# EAGLE design Power-Resistor-Breakout-3W-v001 (EAGLE 6.0)
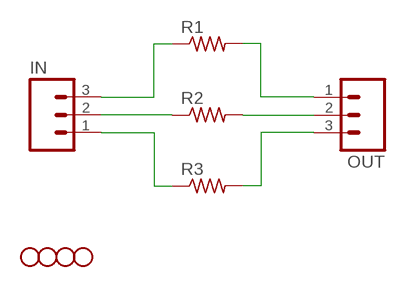
[diagram p0: schematic, sheet 1]

## Parts
IN  M03PTH  [1X03]
JP1  STAND-OFF  [STAND-OFF]
JP2  STAND-OFF  [STAND-OFF]
JP3  STAND-OFF  [STAND-OFF]
JP4  STAND-OFF  [STAND-OFF]
OUT  M03PTH  [1X03]
R1  R-US_0411/15  [0411/15]
R2  R-US_0411/15  [0411/15]
R3  R-US_0411/15  [0411/15]

## Nets
N$1: IN.2 R2.1
N$2: OUT.2 R2.2
N$3: IN.3 R1.1
N$4: IN.1 R3.1
N$5: OUT.3 R3.2
N$6: OUT.1 R1.2

## Library data of the parts
IN OUT = SparkFun:M03: Header 3 Standard 3-pin 0.1" header. Use with straight break away headers (SKU : PRT-00116), right angle break away headers (PRT-00553), swiss pins (PRT-00743), machine pins (PRT-00117), and female headers (PRT-00115). Molex polarized connector foot print use with SKU : PRT-08232 with associated crimp pins and housings.
JP1-JP4 = SparkFun:STAND-OFF: Stand Off This is the mechanical footprint for a #4 phillips button head screw. Use the keepout ring to avoid running the screw head into surrounding components. SKU : PRT-00447
R1-R3 = resistor:R-US_: RESISTOR, American symbol

## Board
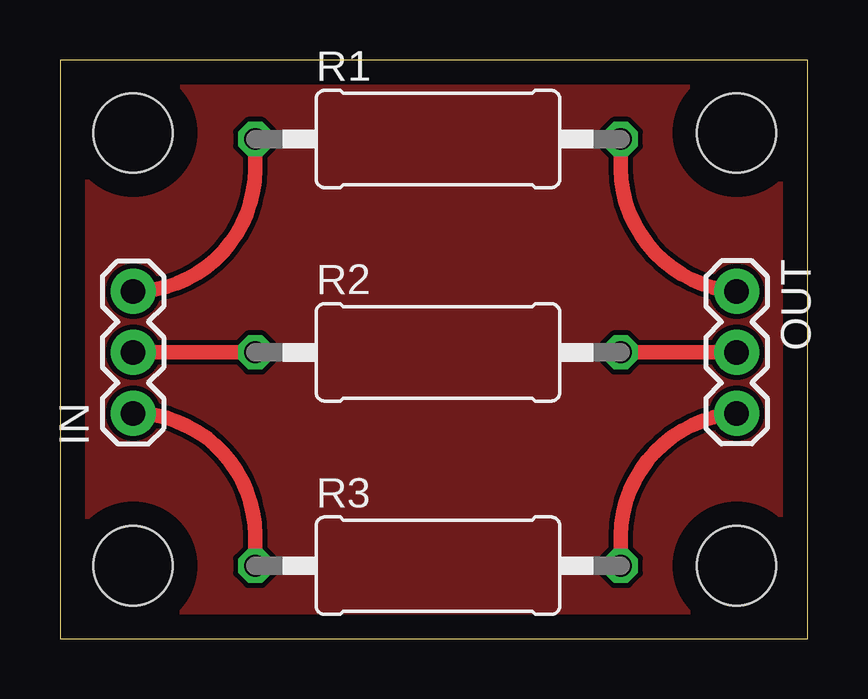
[diagram p1: board, top side]
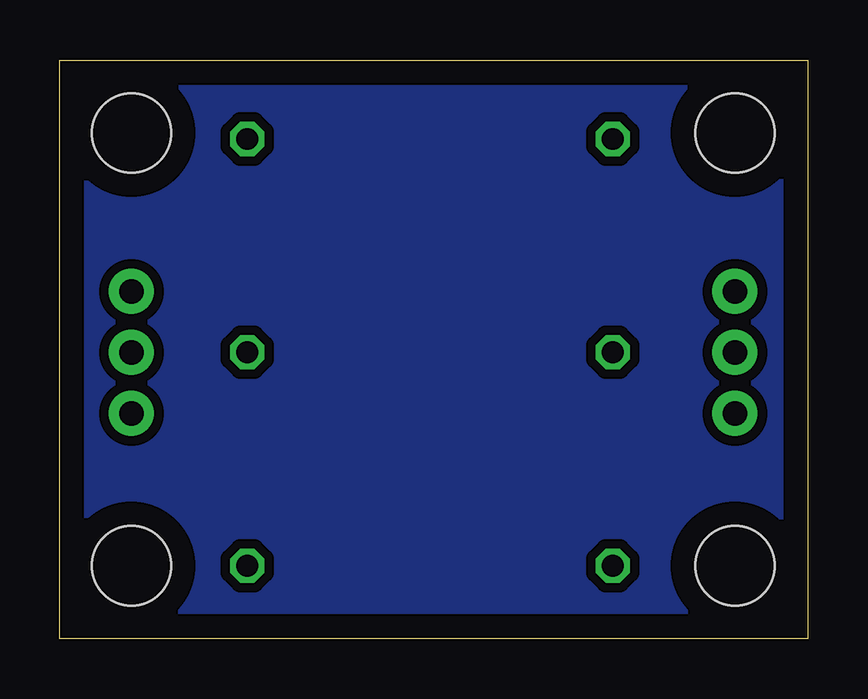
[diagram p2: board, bottom side, seen from below]

Size 31.17 x 24.12 mm. Coordinates in mm from the lower left corner, seen from the top.
Outline: 0,0 31.17,0 31.17,24.12 0,24.12 0,0
Copper layers (1*16): Top 0.035mm / dielectric 1.5mm / Bottom 0.035mm
Design rules: minimum track width 10mil, minimum drill 24mil, track to track 8mil, track to pad 8mil, pad to pad 8mil, via to via 8mil, smd to smd 8mil, copper to edge 40mil, drill to drill 8mil, minimum pad ring 10mil, minimum via ring 8mil, stop-mask expansion 4mil, vias tented up to drill 0mil, thermal gap 10mil

### Footprints (pad centres in the part's own frame; a part is rotated, then mirrored left to right if it is on the bottom)
1X03 = drill 1.016 pad 1.88: 1 0,0; 2 2.54,0; 3 5.08,0
STAND-OFF = hole 3.302: 0,0
0411/15 = drill 0.914 octagon: 1 -7.62,0; 2 7.62,0

### Placement (x,y rotation side)
IN  3.05,9.4 90 top
JP1  3.05,3.05 0 top
JP2  3.05,21.08 0 top
JP3  28.19,3.05 0 top
JP4  28.19,21.08 0 top
OUT  28.19,14.48 270 top
R1  15.75,20.83 0 top
R2  15.75,11.94 0 top
R3  15.75,3.05 0 top

### Tracks (layer width: path | path; a pad name or v marks a point on that pad's centre or on a via)
GND
  pour Top: 0,-0.25 31.5,-0.25 31.5,24.38 -0.25,24.38 -0.25,-0.25
  pour Bottom (isolate 0.406): -0.25,-0.25 31.5,-0.25 31.5,24.38 -0.25,24.38
N$1
  Top 0.61: IN.2 R2.1
N$2
  Top 0.61: OUT.2 R2.2
N$3
  Top 0.61: R1.1 8.13,19.56 arc-90 IN.3
N$4
  Top 0.61: R3.1 8.13,4.32 arc90 IN.1
N$5
  Top 0.61: R3.2 23.37,3.81 arc-90 OUT.3
N$6
  Top 0.61: R1.2 23.37,20.07 arc90 OUT.1

### Text on the board
tDocu: RED | R | R | G | GREEN | G | B | B | BLUE